# EAGLE design ACS712-v12 (EAGLE 6.2)
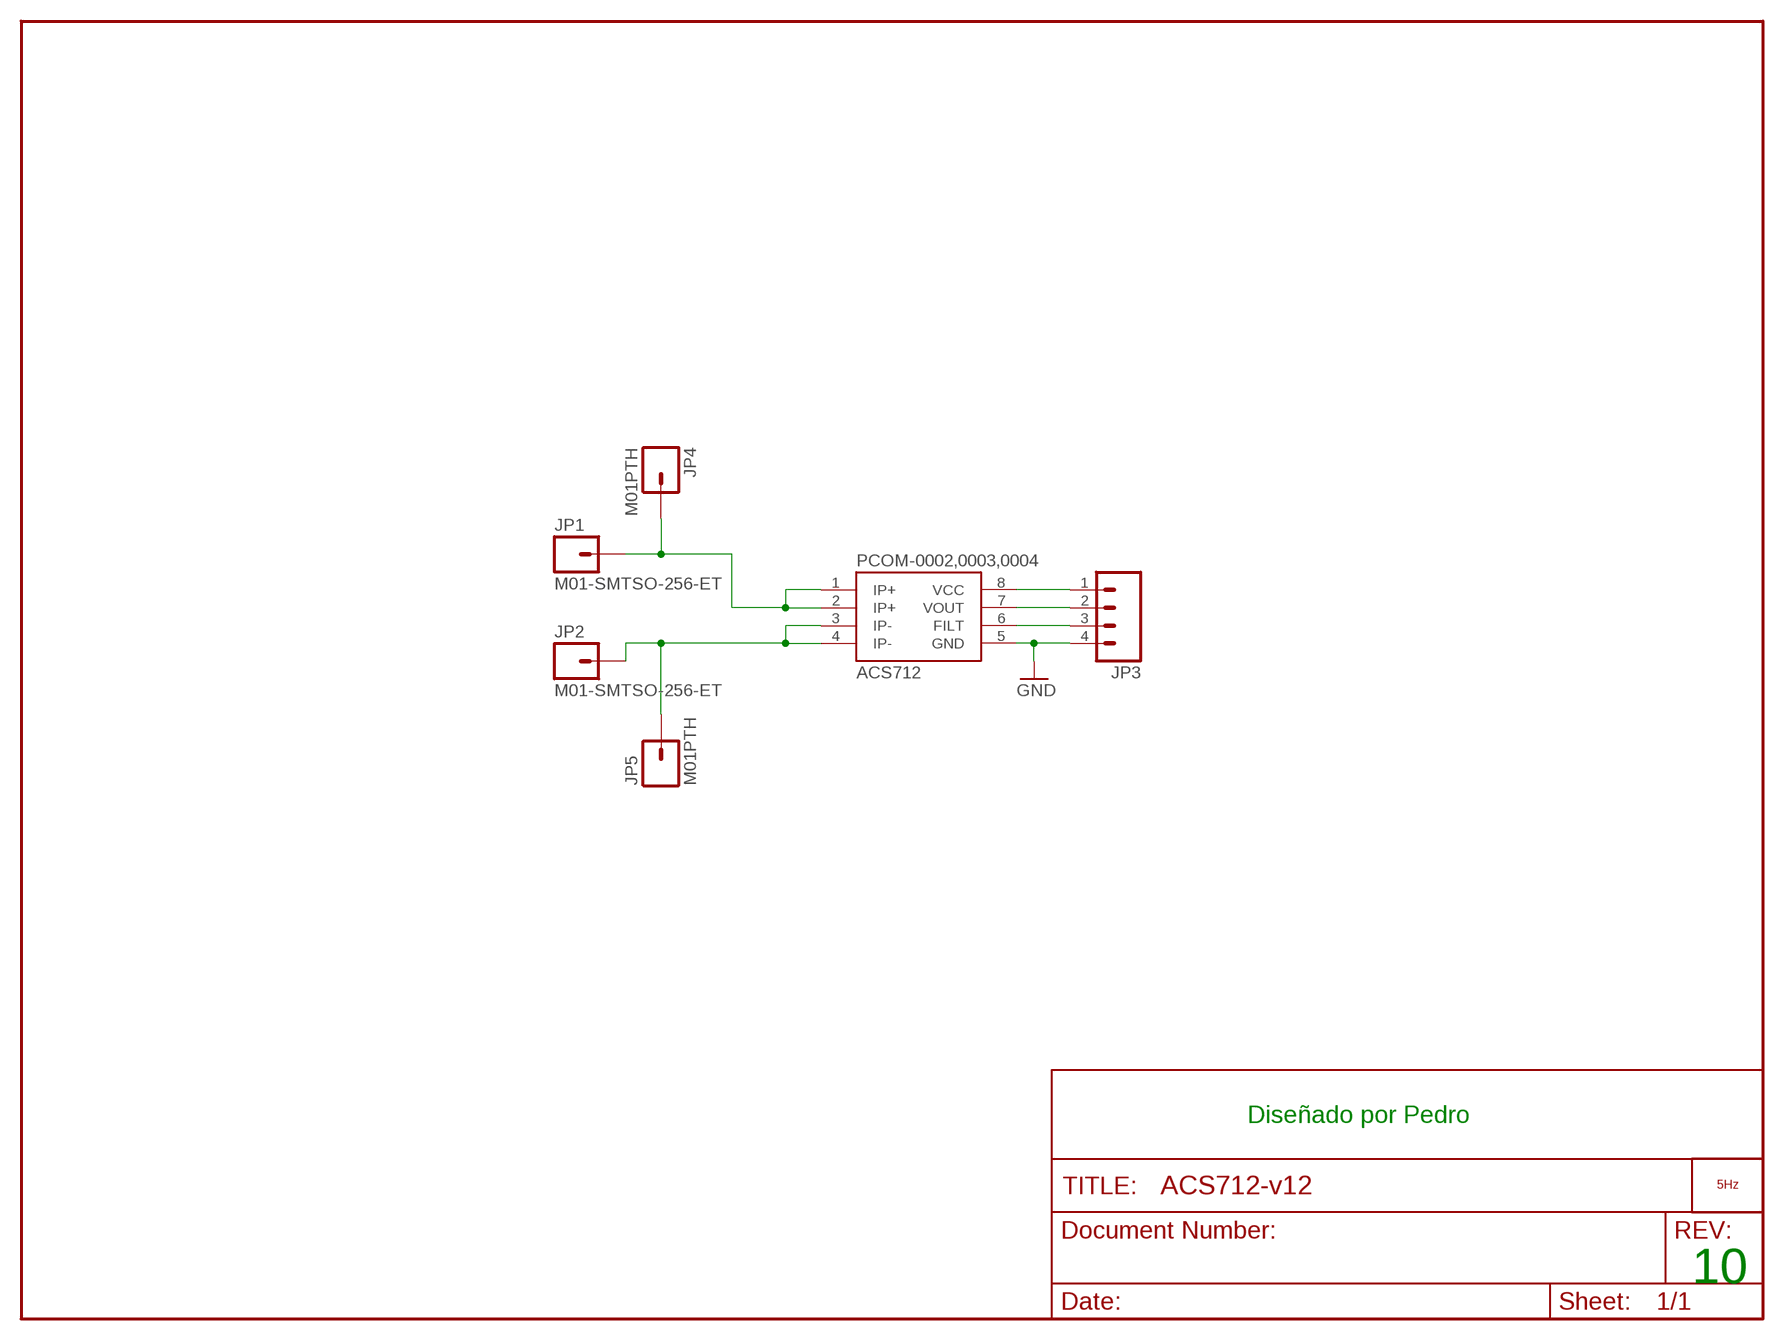
[diagram p0: schematic, sheet 1]

## Parts
JP1  M01-SMTSO-256-ET  [SMTSO-256-ET]
JP2  M01-SMTSO-256-ET  [SMTSO-256-ET]
JP3  M04PTH  [1X04]
JP4  M01PTH  [1X01]
JP5  M01PTH  [1X01]
LOGO1  LOGO_5HZ_H_10MM  [5HZ_LOGO_H_10MM]
PCOM-0002,0003,0004  ACS712  [SO08]

## Nets
GND: JP3.4 PCOM-0002,0003,0004.5(GND)
IP+: JP1.P$1 JP4.1 PCOM-0002,0003,0004.1(IP+) PCOM-0002,0003,0004.2(IP+)
IP-: JP2.P$1 JP5.1 PCOM-0002,0003,0004.3(IP-) PCOM-0002,0003,0004.4(IP-)
N$3: JP3.1 PCOM-0002,0003,0004.8(VCC)
N$4: JP3.2 PCOM-0002,0003,0004.7(VOUT)
N$5: JP3.3 PCOM-0002,0003,0004.6(FILT)

## Notes on the sheet
- Diseñado por Pedro
- 10

## Library data of the parts
JP1 JP2 JP4 JP5 = SparkFun:M01: Header 1 Standard 1-pin 0.1" header. Use with straight break away headers (SKU : PRT-00116), right angle break away headers (PRT-00553), swiss pins (PRT-00743), machine pins (PRT-00117), and female headers (PRT-00115).
JP3 = SparkFun:M04: Header 4 Standard 4-pin 0.1" header. Use with straight break away headers (SKU : PRT-00116), right angle break away headers (PRT-00553), swiss pins (PRT-00743), machine pins (PRT-00117), and female headers (PRT-00115). Molex polarized connector foot print use with SKU : PRT-08231 with associated crimp pins and housings.
LOGO1 = 5hz-electronica:LOGO_5HZ: Logotipo 5Hz "según Pedro"
PCOM-0002,0003,0004 = SparkFun:ACS712

## Board
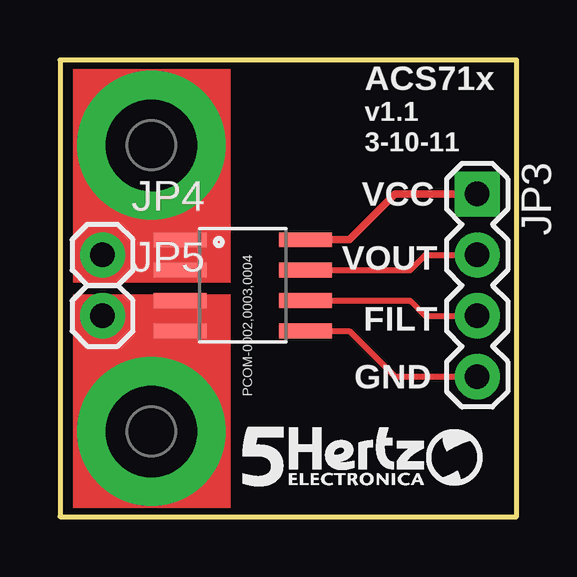
[diagram p1: board, top side]

Size 19.05 x 19.05 mm. Coordinates in mm from the lower left corner, seen from the top.
Outline: 0,0 19.05,0 19.05,19.05 0,19.05 0,0
Copper layers (1*16): Top 0.035mm / dielectric 1.5mm / Bottom 0.035mm
Design rules: minimum track width 8mil, minimum drill 20mil, track to track 8mil, track to pad 8mil, pad to pad 8mil, via to via 8mil, smd to smd 8mil, copper to edge 10mil, drill to drill 8mil, minimum pad ring 12mil, minimum via ring 10mil, stop-mask expansion 4mil, vias tented up to drill 25mil, thermal gap 10mil

### Footprints (pad centres in the part's own frame; a part is rotated, then mirrored left to right if it is on the bottom)
SMTSO-256-ET = drill 3.81 pad 6.198: P$1 0,0
1X04 = drill 1.016 pad 1.88 square: 1 0,0 | drill 1.016 pad 1.88: 2 2.54,0; 3 5.08,0; 4 7.62,0
1X01 = drill 1.016 pad 1.88: 1 0,0
SO08 = smd 0.61 x 2.21: 1 -1.905,-2.616; 2 -0.635,-2.616; 3 0.635,-2.616; 4 1.905,-2.616; 5 1.905,2.616; 6 0.635,2.616; 7 -0.635,2.616; 8 -1.905,2.616

### Placement (x,y rotation side)
JP1  3.81,15.49 0 top
JP2  3.81,3.56 0 top
JP3  17.4,13.46 270 top
JP4  1.78,10.92 0 top
JP5  1.78,8.38 0 top
LOGO1  7.62,1.27 0 top
PCOM-0002,0003,0004  7.62,9.65 270 top

### Tracks (layer width: path | path; a pad name or v marks a point on that pad's centre or on a via)
GND
  Top 0.254: JP3.4 14.68,5.84 13.97,5.84 12.06,7.75 PCOM-0002,0003,0004.5
IP+
  Top 0.254: PCOM-0002,0003,0004.2 5.08,10.29 PCOM-0002,0003,0004.1 5.08,11.56 JP1.P$1 JP4.1
IP-
  Top 0.254: PCOM-0002,0003,0004.3 5.08,9.02 PCOM-0002,0003,0004.4 5.08,7.75 JP2.P$1 JP5.1
N$3
  Top 0.305: JP3.1 14.68,13.46 13.97,13.46 12.06,11.56 PCOM-0002,0003,0004.8
N$4
  Top 0.254: PCOM-0002,0003,0004.7 14.61,10.29 15.24,10.92 JP3.2
N$5
  Top 0.254: PCOM-0002,0003,0004.6 14.61,9.02 15.24,8.38 JP3.3
(copper drawn outside any net)
  shapes: Top area x2

### Text on the board
tPlace: ACS71x | v1.1 | 3-10-11 | VCC | VOUT | FILT | GND